# EAGLE design slider_cap v0.1 (EAGLE 7.4.0)
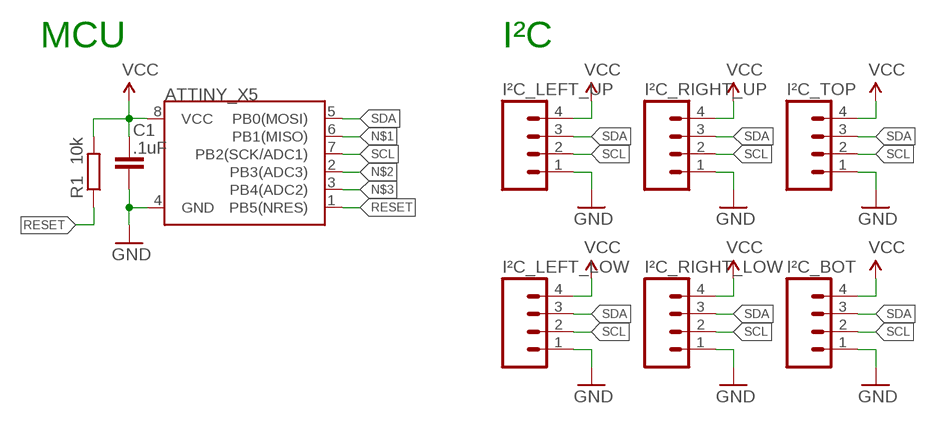
[diagram p0: schematic, sheet 1]

## Parts
ATTINY_X5  ATTINY45TINY45-20-SMT  [SO08-EIAJ]
C1  .1uF  CAPACITOR_NPOL-0805  [C805]
I²C_BOT  M04PTH  [1X04]
I²C_LEFT_LOW  M04PTH  [1X04]
I²C_LEFT_UP  M04PTH  [1X04]
I²C_RIGHT_LOW  M04PTH  [1X04]
I²C_RIGHT_UP  M04PTH  [1X04]
I²C_TOP  M04PTH  [1X04]
R1  10k  RESISTORR805-0805  [R805]

## Nets
GND: ATTINY_X5.4(GND) C1.2 I²C_BOT.1 I²C_LEFT_LOW.1 I²C_LEFT_UP.1 I²C_RIGHT_LOW.1 I²C_RIGHT_UP.1 I²C_TOP.1
N$1: ATTINY_X5.6(PB1(MISO))
N$2: ATTINY_X5.2(PB3(ADC3))
N$3: ATTINY_X5.3(PB4(ADC2))
RESET: ATTINY_X5.1(PB5(NRES)) R1.1
SCL: ATTINY_X5.7(PB2(SCK/ADC1)) I²C_BOT.2 I²C_LEFT_LOW.2 I²C_LEFT_UP.2 I²C_RIGHT_LOW.2 I²C_RIGHT_UP.2 I²C_TOP.2
SDA: ATTINY_X5.5(PB0(MOSI)) I²C_BOT.3 I²C_LEFT_LOW.3 I²C_LEFT_UP.3 I²C_RIGHT_LOW.3 I²C_RIGHT_UP.3 I²C_TOP.3
VCC: ATTINY_X5.8(VCC) C1.1 I²C_BOT.4 I²C_LEFT_LOW.4 I²C_LEFT_UP.4 I²C_RIGHT_LOW.4 I²C_RIGHT_UP.4 I²C_TOP.4 R1.2

## Notes on the sheet
- MCU | I²C

## Library data of the parts
ATTINY_X5 = SparkFun-DigitalIC:ATTINY45: Atmel 8-pin 2/4/8kB flash uC; PROD_ID: IC-08922; VALUE: Tiny45-20-SMT
C1 = dp_devices:CAPACITOR_NPOL: Non-Polarized capacitor in various packages
I²C_BOT I²C_LEFT_LOW I²C_LEFT_UP I²C_RIGHT_LOW I²C_RIGHT_UP I²C_TOP = SparkFun-Connectors:M04: Header 4 Standard 4-pin 0.1" header. Use with straight break away headers (SKU : PRT-00116), right angle break away headers (PRT-00553), swiss pins (PRT-00743), machine pins (PRT-00117), and female headers (PRT-00115). Molex polarized connector foot print use with SKU : PRT-08231 with associated crimp pins and housings. 1MM SMD Version SKU: PRT-10208
R1 = dp_devices:RESISTOR

## Board
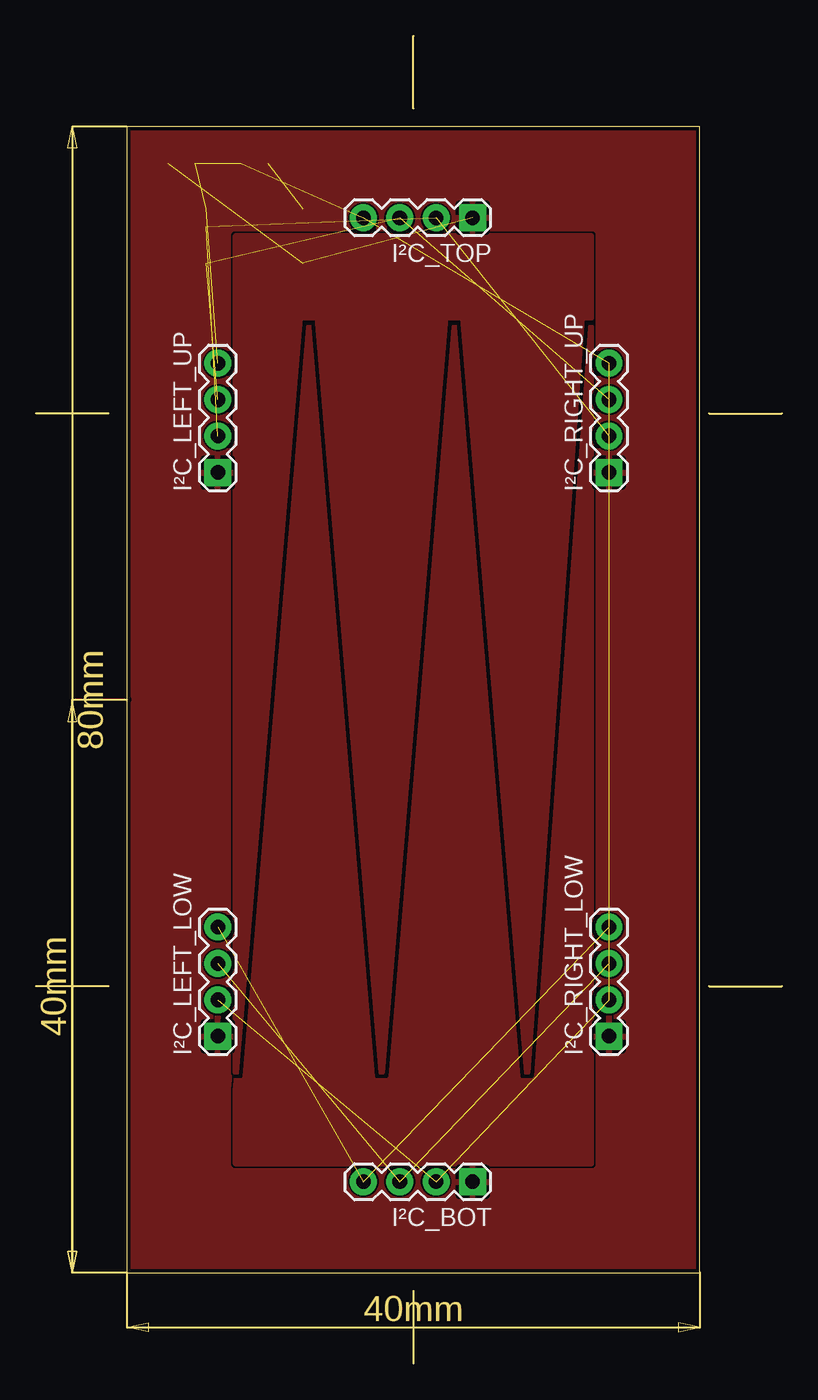
[diagram p1: board, top side]
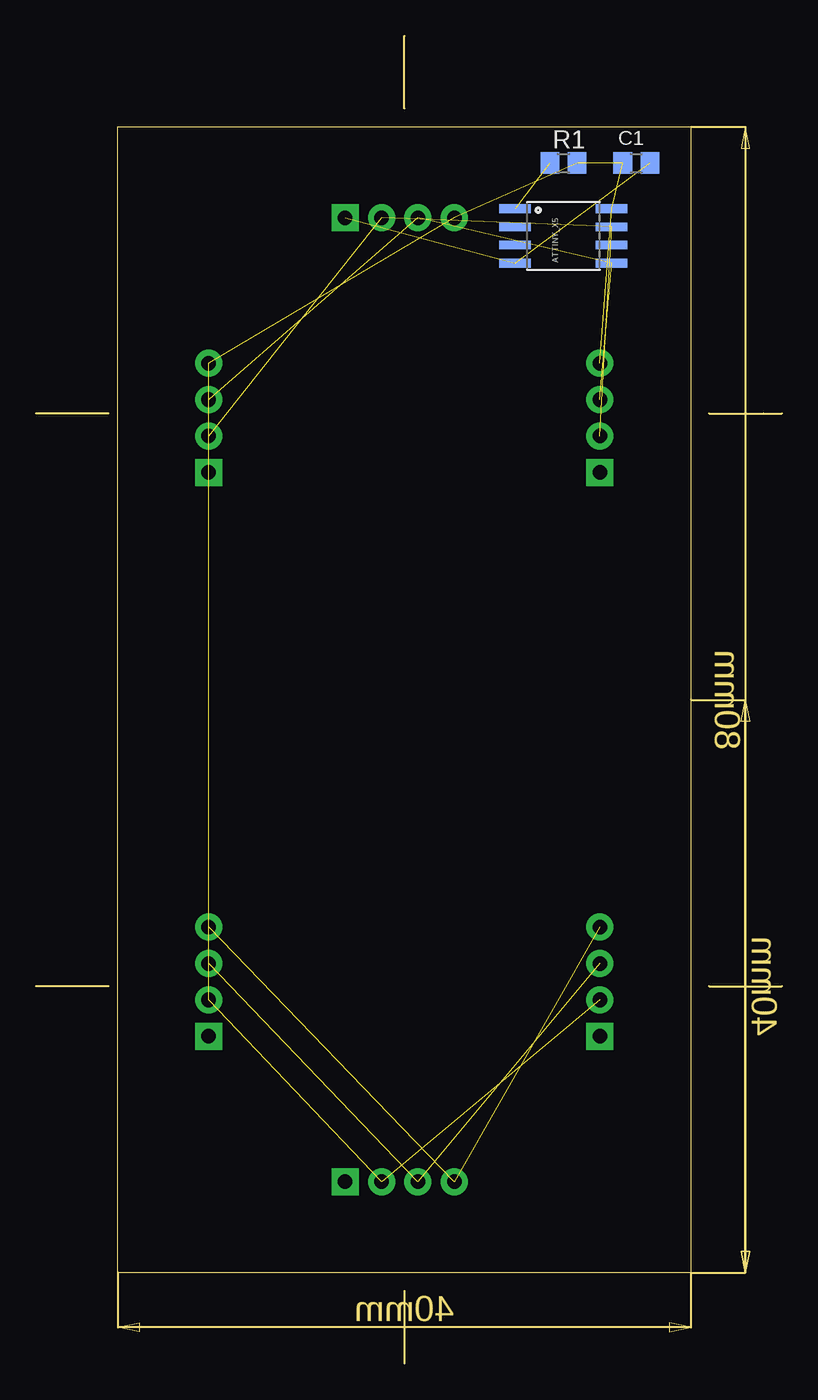
[diagram p2: board, bottom side, seen from below]

Size 40 x 80 mm. Coordinates in mm from the lower left corner, seen from the top.
Outline: 0,0 40,0 40,80 0,80 0,0
Copper layers (1*16): Top 0.035mm / dielectric 1.5mm / Bottom 0.035mm
Design rules "dirt_cheap_dirty_boards.v1": minimum track width 5mil, minimum drill 12mil, track to track 5mil, track to pad 5mil, pad to pad 5mil, via to via 5mil, smd to smd 0mil, copper to edge 10mil, drill to drill 10mil, minimum pad ring 10mil, minimum via ring 6mil, stop-mask expansion 2mil, vias tented up to drill 25mil, thermal gap 10mil

### Footprints (pad centres in the part's own frame; a part is rotated, then mirrored left to right if it is on the bottom)
SO08-EIAJ = smd 0.61 x 2.21: 1 -1.905,-3.378; 2 -0.635,-3.378; 3 0.635,-3.378; 4 1.905,-3.378; 5 1.905,3.353; 6 0.635,3.353; 7 -0.635,3.353; 8 -1.905,3.353
C805 = smd 1.3 x 1.5: 1 -0.95,0; 2 0.95,0
1X04 = drill 1.016 pad 1.88 square: 1 0,0 | drill 1.016 pad 1.88: 2 2.54,0; 3 5.08,0; 4 7.62,0
R805 = smd 1.3 x 1.5: 1 -0.95,0; 2 0.95,0

### Placement (x,y rotation side)
ATTINY_X5  8.89,72.39 270 bottom
C1  3.81,77.47 0 bottom
I²C_BOT  24.13,6.35 180 top
I²C_LEFT_LOW  6.35,16.51 90 top
I²C_LEFT_UP  6.35,55.88 90 top
I²C_RIGHT_LOW  33.66,16.51 90 top
I²C_RIGHT_UP  33.66,55.88 90 top
I²C_TOP  24.13,73.66 180 top
R1  8.89,77.47 0 bottom

### Tracks (layer width: path | path; a pad name or v marks a point on that pad's centre or on a via)
GND  (2 unrouted)
  pour Top (rank 3): 0,0 40.64,0 40.64,80.01 0,80.01
PAD1
  pour Top (isolate 0.254): 7.62,13.97 7.62,72.39 32.38,72.39 32.38,66.67 31.75,66.67 27.94,13.97 23.5,66.67 22.23,66.67 17.78,13.97 13.34,66.67 12.06,66.67
PAD2
  pour Top (isolate 0.254, rank 2): 32.38,66.04 32.38,7.62 7.62,7.62 7.62,12.7 12.7,66.04 17.78,12.7 22.86,66.04 27.94,12.7
RESET  (1 unrouted)
SCL  (6 unrouted)
SDA  (6 unrouted)
VCC  (8 unrouted)